# EAGLE design 5VAC-DC (EAGLE 9.6.2)
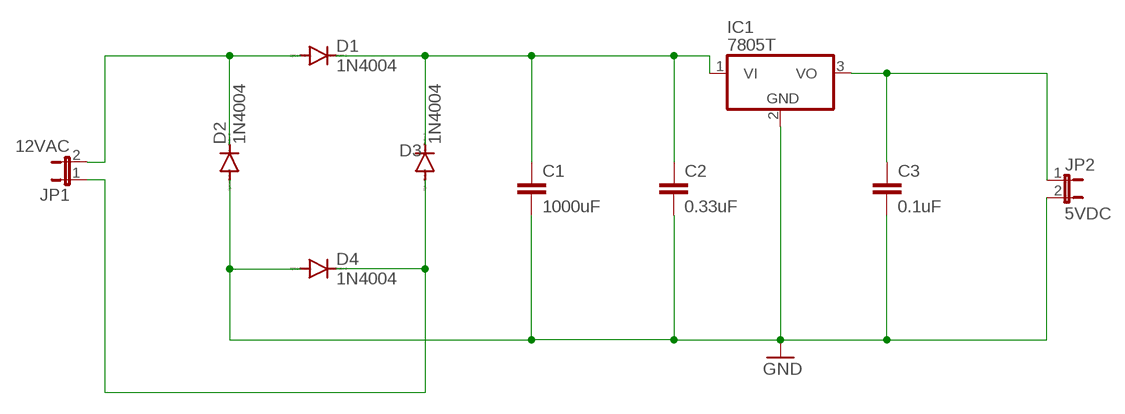
[diagram p0: schematic, sheet 1]

## Parts
C1  1000uF  C2,5-3  [C2.5-3]
C2  0.33uF  C2,5-3  [C2.5-3]
C3  0.1uF  C2,5-3  [C2.5-3]
D1  1N4004  [DO41-10]
D2  1N4004  [DO41-10]
D3  1N4004  [DO41-10]
D4  1N4004  [DO41-10]
IC1  7805T  [TO220H]
JP1  12VAC  JP1E  [JP1]
JP2  5VDC  JP1E  [JP1]

## Nets
GND: C1.2 C2.2 C3.2 D2.A D4.A IC1.2(GND) JP2.2
N$1: D1.A D2.C JP1.2
N$2: C1.1 C2.1 D1.C D3.C IC1.1(VI)
N$3: D3.A D4.C JP1.1
N$6: C3.1 IC1.3(VO) JP2.1

## Library data of the parts
C1-C3 = capacitor-wima:C: CAPACITOR naming: grid - package width
D1-D4 = diode:1N4004: DIODE general purpose rectifier, 1 A
IC1 = linear:78*: Positive VOLTAGE REGULATOR Source: http://cache.national.com/ds/LM/LM78L05.pdf http://www.fairchildsemi.com/ds/LM/LM7805.pdf
JP1 JP2 = jumper:JP1E: JUMPER

## Board
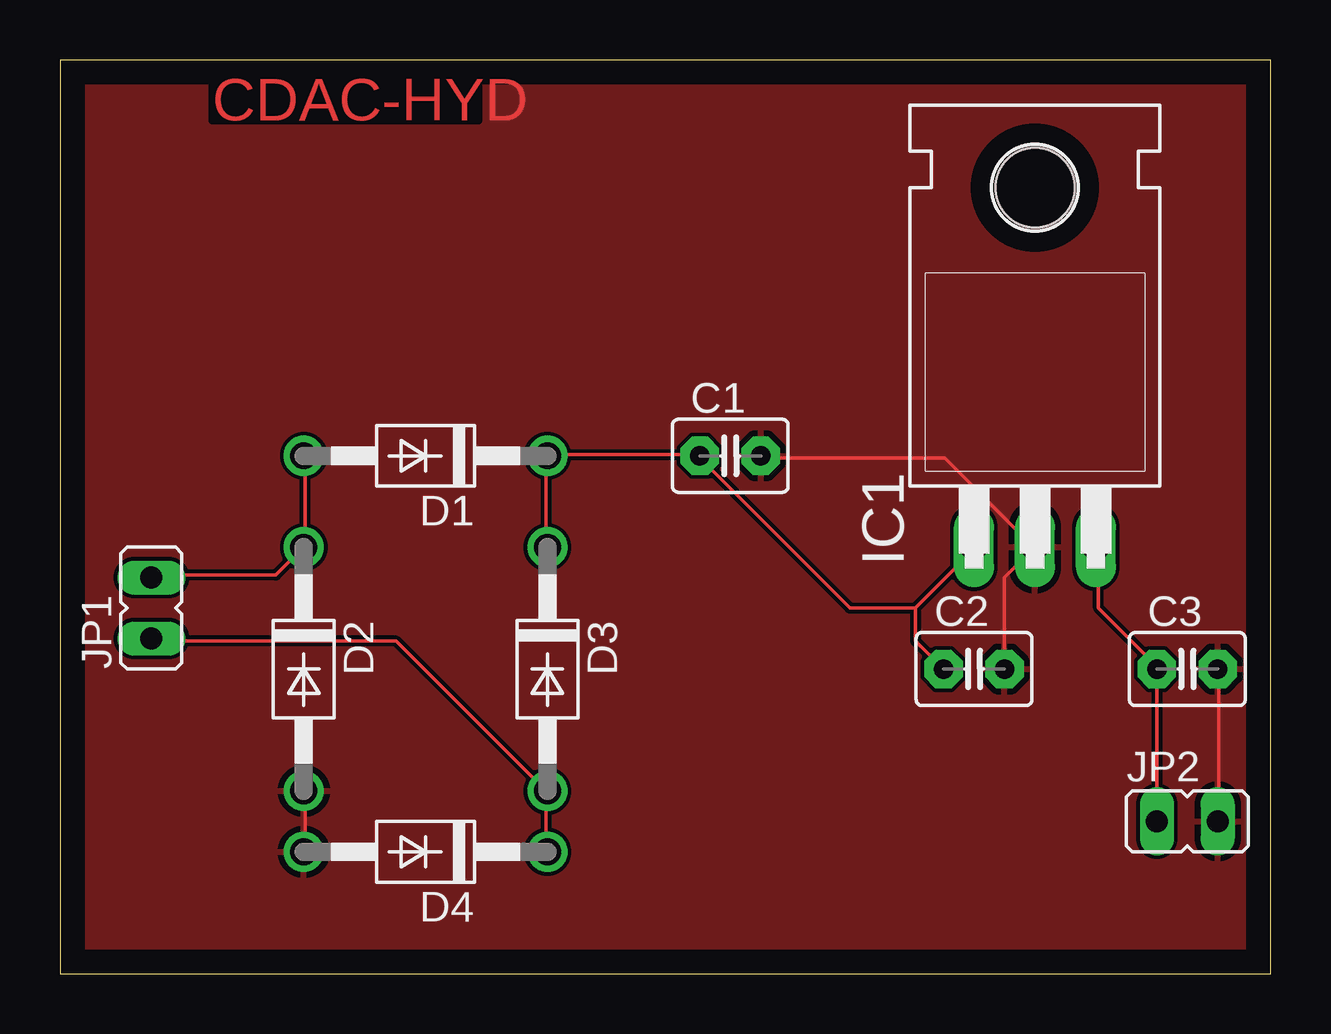
[diagram p1: board, top side]
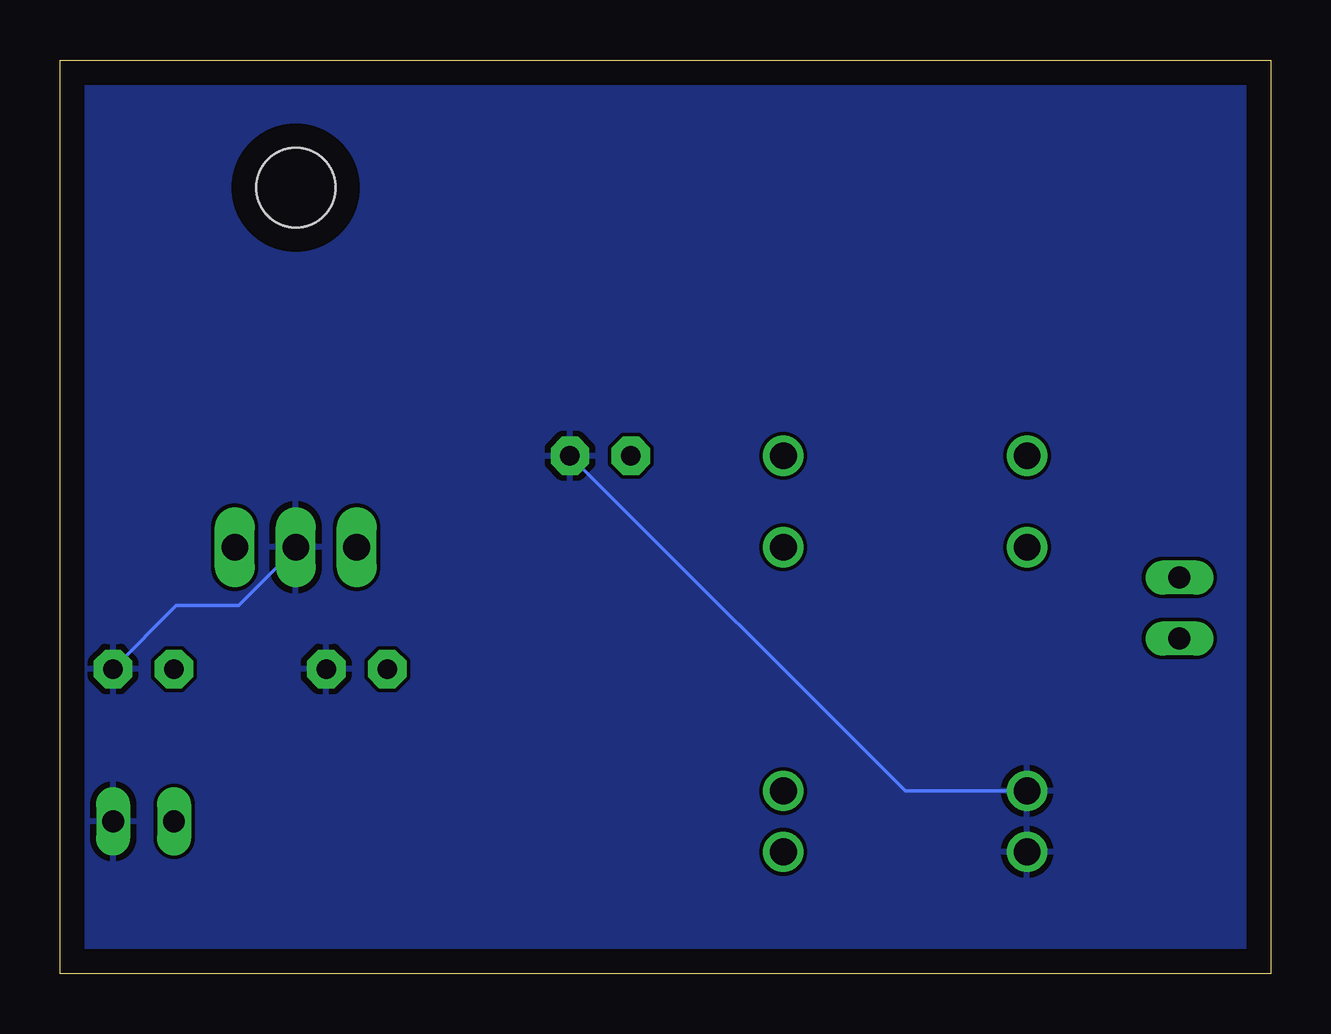
[diagram p2: board, bottom side, seen from below]

Size 50.47 x 38.09 mm. Coordinates in mm from the lower left corner, seen from the top.
Outline: 0,0 50.47,0 50.47,38.09 0,38.09 0,0
Copper layers (1*16): Top 0.035mm / dielectric 1.5mm / Bottom 0.035mm
Design rules "default": minimum track width 6mil, minimum drill 0.35mm, track to track 6mil, track to pad 6mil, pad to pad 6mil, via to via 6mil, smd to smd 6mil, copper to edge 40mil, drill to drill 6mil, minimum pad ring 10mil, minimum via ring 8mil, stop-mask expansion 4mil, vias tented up to drill 0mil, thermal gap 10mil

### Footprints (pad centres in the part's own frame; a part is rotated, then mirrored left to right if it is on the bottom)
C2.5-3 = drill 0.813 pad 1.6 octagon: 1 -1.27,0; 2 1.27,0
DO41-10 = drill 1.118: A 5.08,0; C -5.08,0
TO220H = drill 1.118 long: 1 -2.54,-10.16; 2 0,-10.16; 3 2.54,-10.16 | hole 3.302: 0,4.826
JP1 = drill 0.914 long: 1 0,-1.27; 2 0,1.27

### Placement (x,y rotation side)
C1  27.94,21.59 0 top
C2  38.1,12.7 0 top
C3  46.99,12.7 0 top
D1  15.24,21.59 180 top
D2  10.16,12.7 270 top
D3  20.32,12.7 270 top
D4  15.24,5.08 180 top
IC1  40.64,27.94 0 top
JP1  3.81,15.24 0 top
JP2  46.99,6.35 270 top

### Tracks (layer width: path | path; a pad name or v marks a point on that pad's centre or on a via)
GND
  Top 0.152: JP2.2 48.31,6.4 48.31,12.65 C3.2 | D4.A 10.21,5.18 10.21,7.62 D2.A | C2.2 39.37,16.51 IC1.2 40.54,17.83 36.88,21.49 29.26,21.49 C1.2
  Bottom 0.152: D2.A 15.24,7.62 C1.2 | C3.2 45.62,15.34 43.03,15.34 40.69,17.68 IC1.2
  pour Top: -1.27,39.37 52.07,39.37 52.07,-1.27 -1.27,-1.27 -1.27,0
  pour Bottom: -2.54,40.64 53.34,40.64 53.34,-2.54 -2.54,-2.54
N$1
  Top 0.152: JP1.2 3.81,16.61 8.99,16.61 D2.C 10.21,17.83 10.21,21.49 D1.A
N$2
  Top 0.152: 35.66,15.24 35.66,13.87 C2.1 | 35.66,15.24 38.1,17.68 IC1.1 | D3.C 20.27,17.83 20.27,21.49 D1.C 20.42,21.64 26.67,21.64 C1.1 26.67,21.49 32.92,15.24 35.66,15.24
N$3
  Top 0.152: 20.27,7.62 14.02,13.87 3.81,13.87 JP1.1 | 20.27,7.62 20.27,5.18 D4.C | 20.27,7.62 D3.A
N$6
  Top 0.152: JP2.1 C3.1 45.72,12.8 43.28,15.24 43.28,17.68 IC1.3

### Text on the board
Top: CDAC-HYD